# Altium schematic sheet Dev.SchDoc
size 292 x 193 mm; Author: Power Lin; SheetNumber: 1; SheetTotal: 1; Website: wiki-power.com
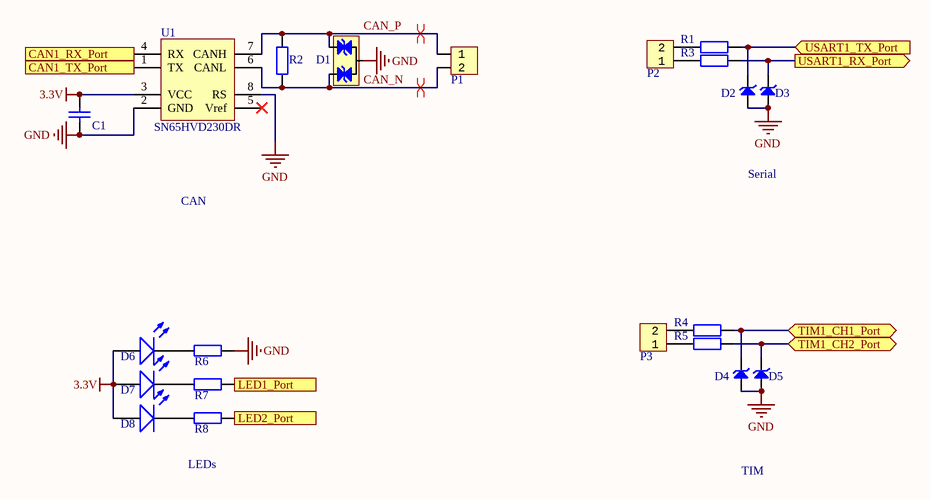
[diagram p0: Dev.SchDoc]

## Parts
C1  100nF  [CAP-0603]  (value not drawn)
D1  PESD2CAN  [SOT-23-3]  (value not drawn)
D2  BZT52C3V9S-7-F  [SOD_323]  (value not drawn)
D3  BZT52C3V9S-7-F  [SOD_323]  (value not drawn)
D4  BZT52C3V9S-7-F  [SOD_323]  (value not drawn)
D5  BZT52C3V9S-7-F  [SOD_323]  (value not drawn)
D6  RED  [LED_0603]  (value not drawn)
D7  RED  [LED_0603]  (value not drawn)
D8  GREEN  [LED_0603]  (value not drawn)
P1  HDR1x2_2.54  [HDR1X2_2.54_180]  (value not drawn)
P2  HDR1x2_2.54  [HDR1X2_2.54_180]  (value not drawn)
P3  HDR1x2_2.54  [HDR1X2_2.54_180]  (value not drawn)
R1  100R  [R-0603]  (value not drawn)
R2  120R  [R-0603]  (value not drawn)
R3  100R  [R-0603]  (value not drawn)
R4  100R  [R-0603]  (value not drawn)
R5  100R  [R-0603]  (value not drawn)
R6  4.7K  [R-0603]  (value not drawn)
R7  4.7K  [R-0603]  (value not drawn)
R8  4.7K  [R-0603]  (value not drawn)
U1  SN65HVD230DR  [SOIC_8]

## Ports
CAN1_RX_Port (out), CAN1_TX_Port (in), LED1_Port (in), LED2_Port (in), TIM1_CH1_Port (bidir), TIM1_CH2_Port (bidir), USART1_RX_Port (out), USART1_TX_Port (in)

## Nets
3.3V: C1.2 D6.A D7.A D8.A U1.3(VCC)
GND: C1.1 D1.3 D2.1 D3.1 D4.1 D5.1 R6.2 U1.2(GND) U1.8(RS)
CAN1_RX_Port: U1.4(RX) ; port CAN1_RX_Port
CAN1_TX_Port: U1.1(TX) ; port CAN1_TX_Port
CAN_N: D1.1 P1.2 R2.1 U1.6(CANL)
CAN_P: D1.2 P1.1 R2.2 U1.7(CANH)
LED1_Port: R7.2 ; port LED1_Port
LED2_Port: R8.2 ; port LED2_Port
TIM1_CH1_Port: D4.2 R4.2 ; port TIM1_CH1_Port
TIM1_CH2_Port: D5.2 R5.2 ; port TIM1_CH2_Port
USART1_RX_Port: D3.2 R3.2 ; port USART1_RX_Port
USART1_TX_Port: D2.2 R1.2 ; port USART1_TX_Port
NetD6_K: D6.K R6.1
NetD7_K: D7.K R7.1
NetD8_K: D8.K R8.1
NetP2_1: P2.1 R3.1
NetP2_2: P2.2 R1.1
NetP3_1: P3.1 R5.1
NetP3_2: P3.2 R4.1

Not connected (* = marked no-connect by the designer): U1 5(Vref)*

## Layout directives
differential pair: CAN_N, CAN_P

## Notes on the sheet
- CAN
- Serial
- LEDs
- TIM
- Author
- DocumentName
- ModifiedDate
- ProjectName
- SheetNumber
- SheetTotal
- Website
- Revision

## Library data of the parts
C1 = CAP: 贴片电容; ComponentLink1Description: 供应商链接; ComponentLink1URL: http://www.szlcsc.com/product/details_53938.html; Package: 0402; Supplier: LC; SuppliersPartNumber: C52923
D1 = TVS_C2: TVS 双向x2
D2-D5 = TVS: TVS 二极管
D6-D8 = LED: 发光二极管; ComponentLink1Description: 供应商链接; ComponentLink1URL: http://www.szlcsc.com/product/details_2663.html; Package: 0603; Supplier: LC; SuppliersPartNumber: C2290
P1-P3 = HDR1x2_2.54: Header
R1-R8 = RES: 贴片电阻; Package: 0805; Supplier: LC; SuppliersPartNumber: C17798
U1 = SN65HVD230DR: CAN 控制器（3.3V）